# EasyEDA schematic SCH_Flight controller pcb_2024-07-04.json
TITLE: Sheet_1; REV: 1.0; Date: 2024-07-03; Sheet: 1/1; Drawn By: yachitguliani2005; Company: Your Company
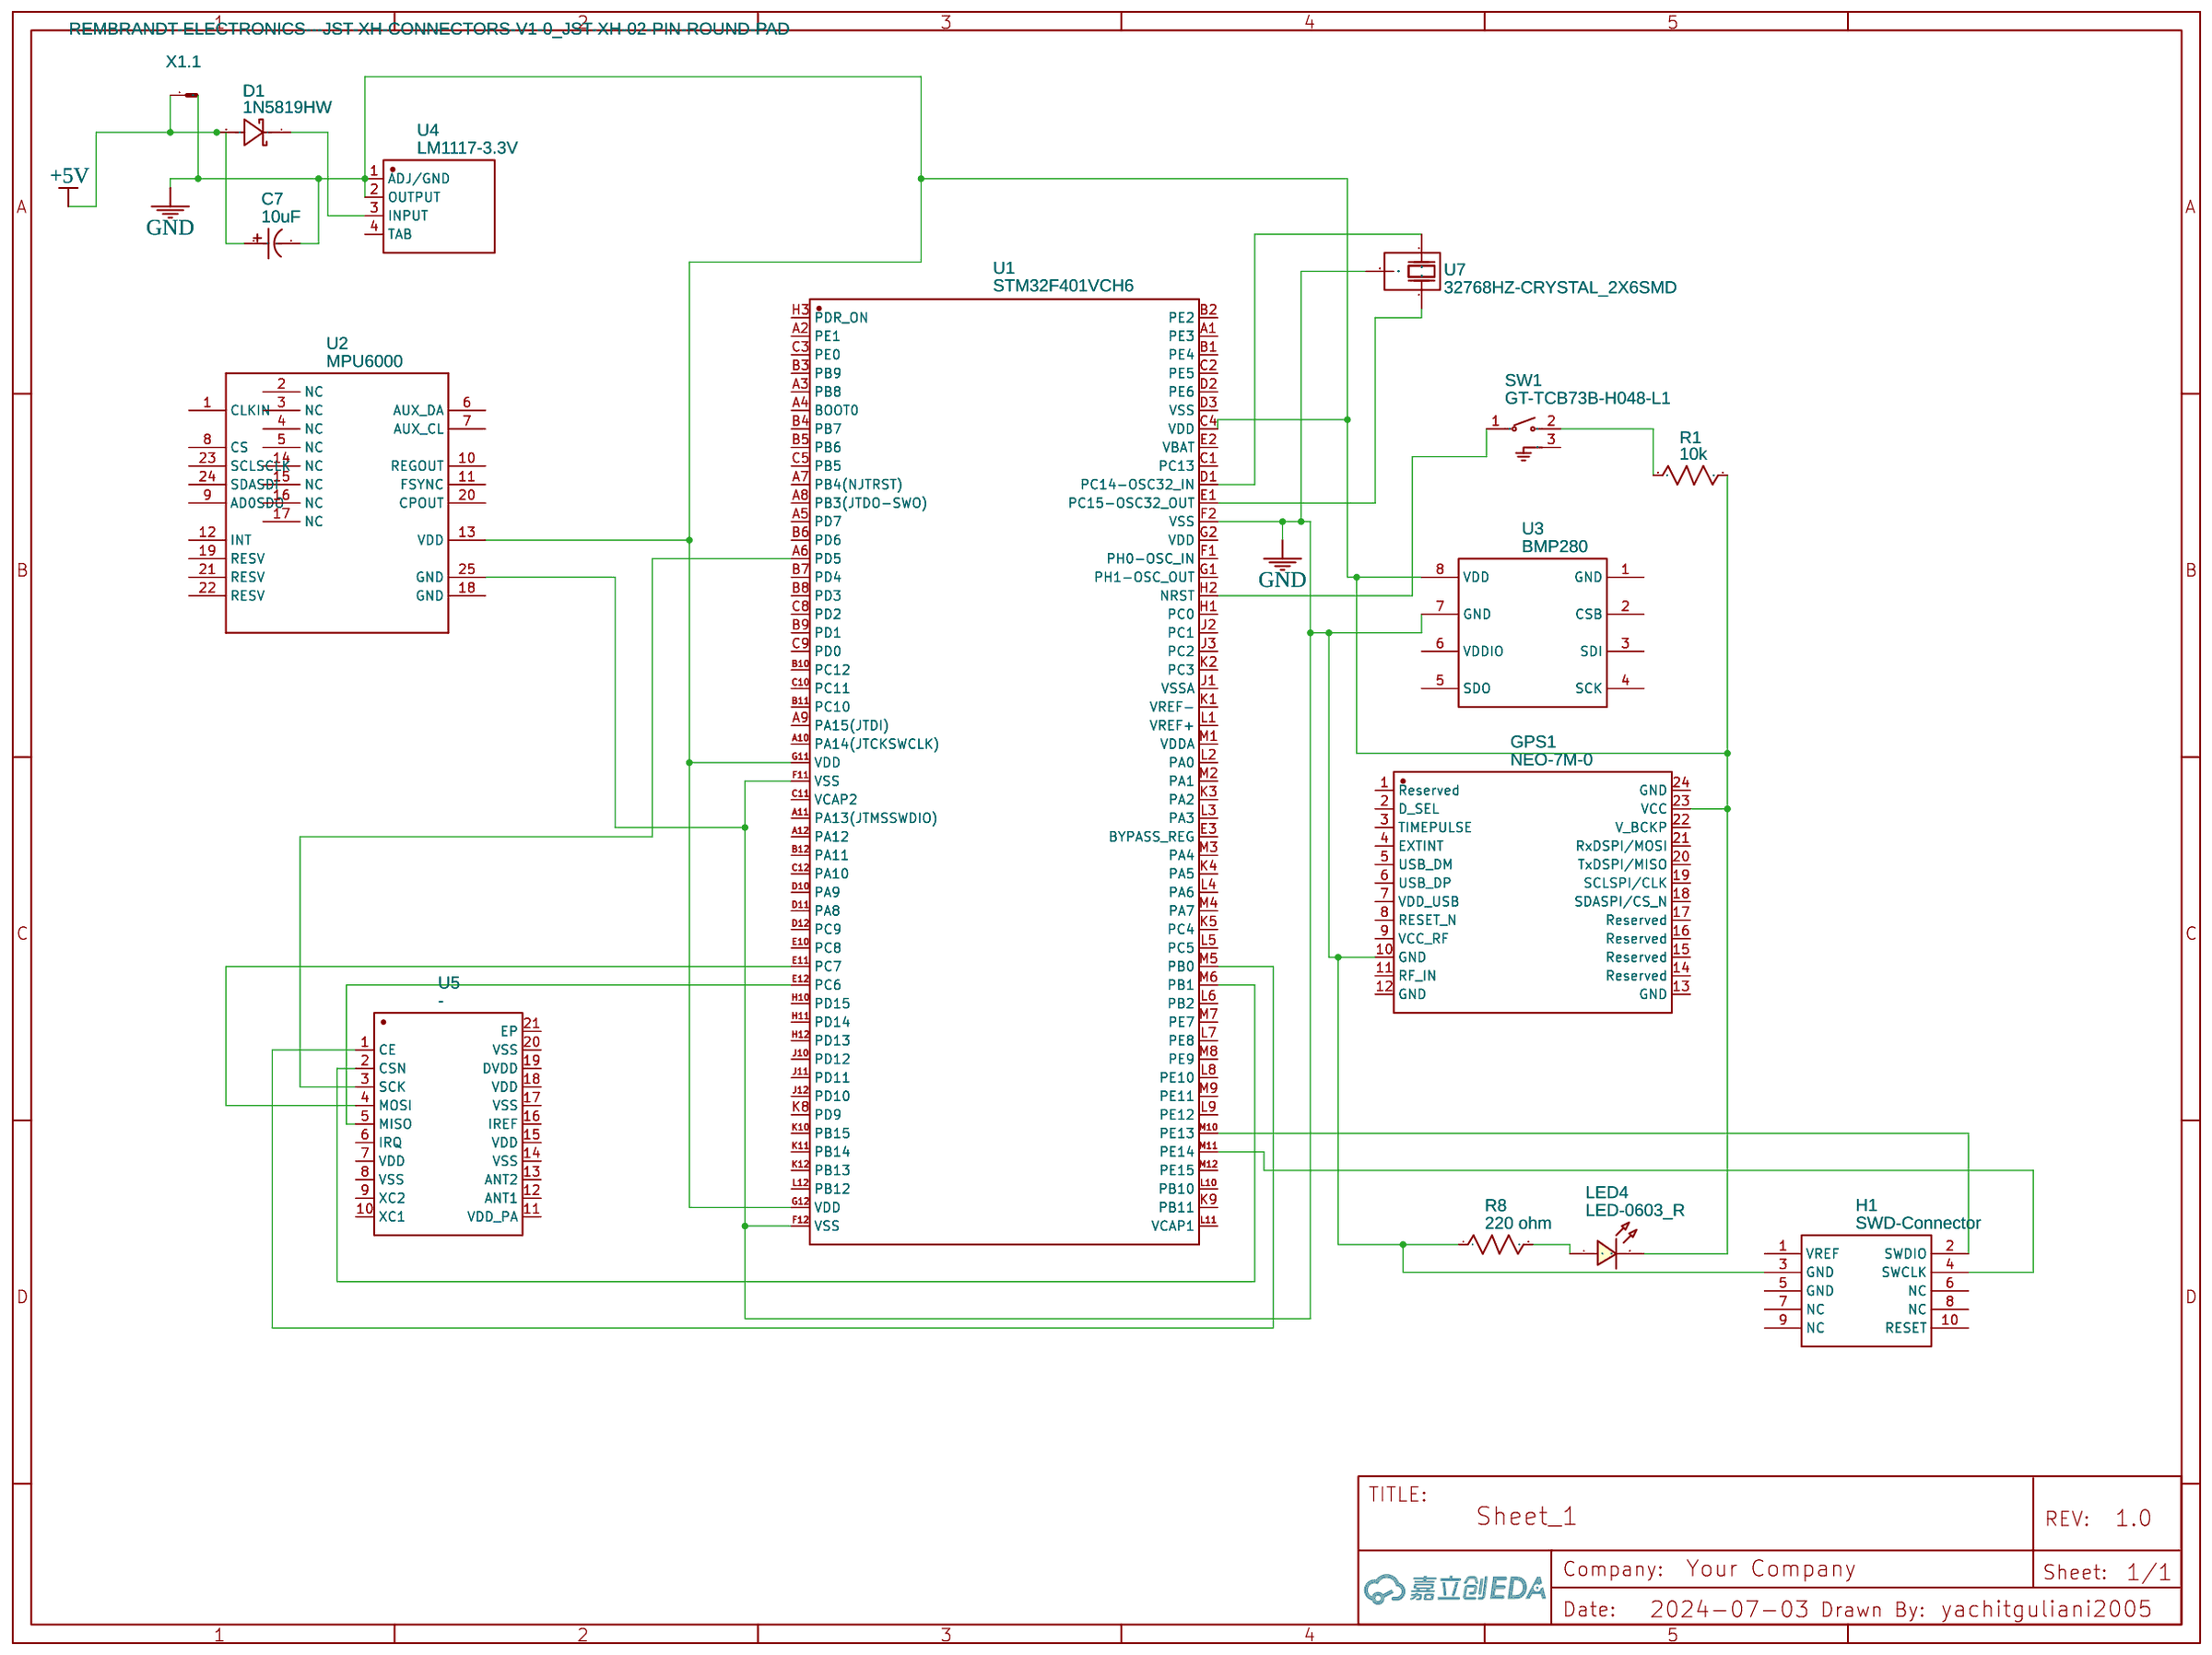
[diagram p0: schematic sheet]

## Parts
C7  10uF  [CAP-TH_BD4.0-P1.50-D0.8-FD]
D1  1N5819HW  [SOD-123_L2.7-W1.6-LS3.7-RD-1]
GPS1  NEO-7M-0  [GPS-SMD_NEO-7M-0]
H1  SWD-Connector  [SWD-CONNECTOR-SQUARE]
LED4  LED-0603_R  [LED0603_RED]
R1  10k  [R0603]
R8  220 ohm  [R0603]
SW1  GT-TCB73B-H048-L1  [SW-TH_G-SWITCH_GT-TCB73B-H048-L1]
U1  STM32F401VCH6  [UFBGA-100_L7.0-W7.0-P0.50-BL-STM32F413VGH6]
U2  MPU6000  [QFN50P400X400X95-25T265X275N]
U3  BMP280  [LGA-8_L2.5-W2.0-P0.65_AMP6127]
U4  LM1117-3.3V  [SOT-223-3_L6.5-W3.4-P2.30-LS7.0-BR]
U5  -  [QFN-20_L4.0-W4.0-P0.50-BL-EP2.7]
U7  32768HZ-CRYSTAL_2X6SMD  [CRYSTAL-SMD_32768HZ-CRYSTAL_2-6SMD]
X1  REMBRANDT-ELECTRONICS---JST-XH-CONNECTORS-V1-0_JST-XH-02-PIN-ROUND-PAD  [REMBRANDT-ELECTRONICS---JST-XH-CONNECTORS-V1-0_JST-XH-02-PACKAGE-ROUND-PAD]  (section 1)

## Library data of the parts
C7 = electrolytic capacitor10UF50V: Supplier: LCSC; Manufacturer: CX(承兴); Supplier Part: C32856; JLCPCB Part Class: Extended Part
D1 = 1N5819HW: Contributor: LCSC; Supplier: LCSC; Supplier Part: C2905649; Manufacturer: TECH PUBLIC(台舟); JLCPCB Part Class: Extended Part
GPS1 = NEO-7M-0: Supplier: LCSC; Supplier Part: C6612031; Manufacturer: U-BLOX; Contributor: lcsc
H1 = SWD-Connector: Manufacturer: 华宇创; Manufacturer Part: 1310-1215CNG1S072001; Supplier Part: C343640; Supplier: LCSC; Contributor: MilesD
LED4 = LED-0603_R: Manufacturer: EVERLIGHT(台湾亿光); Manufacturer Part: 19-217/R6C-AL1M2VY/3T; Supplier Part: C72044; Supplier: LCSC; Contributor: LCEDA_01
R1 R8 = R_0603_US: Contributor: LCEDA_Lib
SW1 = GT-TCB73B-H048-L1: Contributor: LCSC; Supplier: LCSC; Supplier Part: C2890354; Manufacturer: G-Switch(品赞); JLCPCB Part Class: Extended Part
U1 = STM32F401VCH6: Contributor: lcsc; Supplier: LCSC; Supplier Part: C2971398; Manufacturer: ST(意法半导体); JLCPCB Part Class: Extended Part
U2 = MPU6000
U3 = BMP280: Supplier: LCSC; Manufacturer: Bosch(博世); Supplier Part: C83291; JLCPCB Part Class: Extended Part
U4 = LM1117-3.3V: Contributor: LCSC; Supplier: LCSC; Supplier Part: C9900007609; Manufacturer: null; JLCPCB Part Class: Extended Part
U5 = NRF24L01_C1558392: Contributor: LCSC; Supplier: LCSC; Supplier Part: C1558392; Manufacturer: NORDIC
U7 = 32768HZ-CRYSTAL_2X6SMD: Contributor: LCSC; Supplier: LCSC; Supplier Part: C9900008919; Manufacturer: null
X1 = REMBRANDT-ELECTRONICS---JST-XH-CONNECTORS-V1-0_JST-XH-02-PIN-ROUND-PAD: Contributor: basheeraltaweel; subpart_no: 1

## Nets
+5V: C7.1(+) D1.2(A) X1.1(S)
GND: C7.2(-) GPS1.10(GND) GPS1.23(VCC) H1.3(GND) LED4.2 R1.2 R8.1 U1.C4(VDD) U1.F2(VSS) U1.F11(VSS) U1.F12(VSS) U1.G11(VDD) U1.G12(VDD) U2.13(VDD) U2.25(GND) U3.7(GND) U3.8(VDD) U4.1(ADJ/GND) U4.2(OUTPUT) U7.3(GND)
Net-(D1-1): D1.1(K) U4.3(INPUT)
Net-(H1-2): H1.2(SWDIO) U1.M10(PE13)
Net-(H1-4): H1.4(SWCLK) U1.M11(PE14)
Net-(LED4-1): LED4.1 R8.2
Net-(R1-1): R1.1 SW1.2
Net-(SW1-1): SW1.1 U1.H2(NRST)
Net-(U1-A6): U1.A6(PD5) U5.3(SCK)
Net-(U1-D1): U1.D1(PC14-OSC32_IN) U7.1(OSC1)
Net-(U1-E1): U1.E1(PC15-OSC32_OUT) U7.2(OSC2)
Net-(U1-E11): U1.E11(PC7) U5.4(MOSI)
Net-(U1-E12): U1.E12(PC6) U5.5(MISO)
Net-(U1-M5): U1.M5(PB0) U5.1(CE)
Net-(U1-M6): U1.M6(PB1) U5.2(CSN)

Not connected (* = marked no-connect by the designer): GPS1 1(Reserved) 2(D_SEL) 3(TIMEPULSE) 4(EXTINT) 5(USB_DM) 6(USB_DP) 7(VDD_USB) 8(RESET_N) 9(VCC_RF) 11(RF_IN) 12(GND) 13(GND) 14(Reserved) 15(Reserved) 16(Reserved) 17(Reserved) 18(SDASPI/CS_N) 19(SCLSPI/CLK) 20(TxDSPI/MISO) 21(RxDSPI/MOSI) 22(V_BCKP) 24(GND); H1 1(VREF) 5(GND) 6(NC) 7(NC) 8(NC) 9(NC) 10(RESET); SW1 3; U1 A1(PE3) A2(PE1) A3(PB8) A4(BOOT0) A5(PD7) A7(PB4(NJTRST)) A8(PB3(JTDO-SWO)) A9(PA15(JTDI)) A10(PA14(JTCKSWCLK)) A11(PA13(JTMSSWDIO)) A12(PA12) B1(PE4) B2(PE2) B3(PB9) B4(PB7) B5(PB6) B6(PD6) B7(PD4) B8(PD3) B9(PD1) B10(PC12) B11(PC10) B12(PA11) C1(PC13) C2(PE5) C3(PE0) C5(PB5) C8(PD2) C9(PD0) C10(PC11) C11(VCAP2) C12(PA10) D2(PE6) D3(VSS) D10(PA9) D11(PA8) D12(PC9) E2(VBAT) E3(BYPASS_REG) E10(PC8) F1(PH0-OSC_IN) G1(PH1-OSC_OUT) G2(VDD) H1(PC0) H3(PDR_ON) H10(PD15) H11(PD14) H12(PD13) J1(VSSA) J2(PC1) J3(PC2) J10(PD12) J11(PD11) J12(PD10) K1(VREF-) K2(PC3) K3(PA2) K4(PA5) K5(PC4) K8(PD9) K9(PB11) K10(PB15) K11(PB14) K12(PB13) L1(VREF+) L2(PA0) L3(PA3) L4(PA6) L5(PC5) L6(PB2) L7(PE8) L8(PE10) L9(PE12) L10(PB10) L11(VCAP1) L12(PB12) M1(VDDA) M2(PA1) M3(PA4) M4(PA7) M7(PE7) M8(PE9) M9(PE11) M12(PE15); U2 1(CLKIN) 2(NC) 3(NC) 4(NC) 5(NC) 6(AUX_DA) 7(AUX_CL) 8(CS) 9(AD0SDO) 10(REGOUT) 11(FSYNC) 12(INT) 14(NC) 15(NC) 16(NC) 17(NC) 18(GND) 19(RESV) 20(CPOUT) 21(RESV) 22(RESV) 23(SCLSCLK) 24(SDASDI); U3 1(GND) 2(CSB) 3(SDI) 4(SCK) 5(SDO) 6(VDDIO); U4 4(TAB); U5 6(IRQ) 7(VDD) 8(VSS) 9(XC2) 10(XC1) 11(VDD_PA) 12(ANT1) 13(ANT2) 14(VSS) 15(VDD) 16(IREF) 17(VSS) 18(VDD) 19(DVDD) 20(VSS) 21(EP)
